# Altium project Manette2Course.PrjPcb
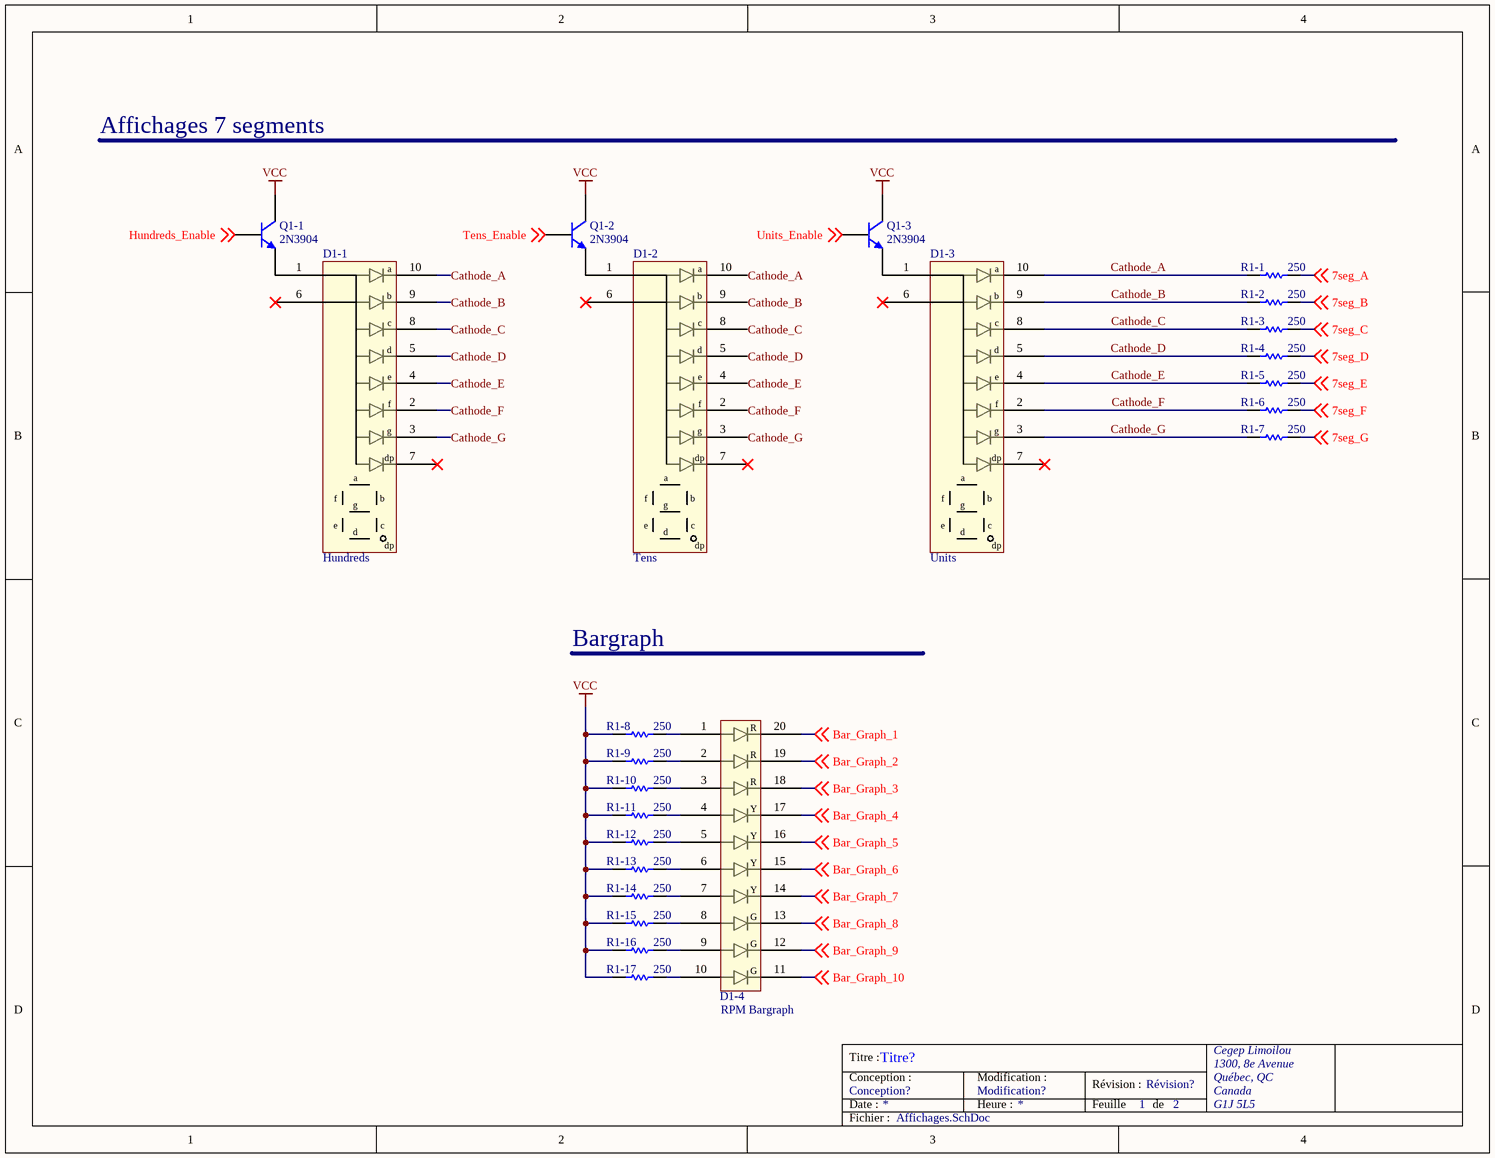
[diagram p0: Affichages.SchDoc]
2 sheets, 34 parts. Net scope: global (net labels, ports and power ports of the same name join across sheets).
Board file: manette.PcbDoc
Sheets:
  Affichages.SchDoc
  Controles.SchDoc

## Sheet Affichages.SchDoc
size Letter; Organization: Cegep Limoilou; Address1: 1300, 8e Avenue; Address2: Québec, QC; Address3: Canada; Address4: G1J 5L5; Revision: Révision?; SheetNumber: 1; SheetTotal: 2; Conception: Conception?; Titre: Titre?; Modification: Modification?; SPICEModelCacheSUUBYXOL: <root> / <DocumentId>SUUBYXOL</DocumentId> / <CacheFrame Number="0"> / <Model Name="2n3904" Kind="MDL"> / <Text>*2N3904 / *Si 310mW  40V 200mA 300MHz pkg:TO-92B 1,2,3 / .MODEL 2N3904 NPN(IS=1.4E-14 BF=300 VAF=100 IKF=0.025 ISE=3E-13 / + BR=7.5 RC=2.4 CJE=4.5E-12 TF=4E-10 CJC=3.5E-12 TR=2.1E-8 XTB=1.5 KF=9E-16 )</Text> / </Model> / </CacheFrame> / </root>

### Parts
D1-1  Hundreds  [LED_7SEG_LSHD-A101]
D1-2  Tens  [LED_7SEG_LSHD-A101]
D1-3  Units  [LED_7SEG_LSHD-A101]
D1-4  RPM Bargraph  [LED_BARGRAPH-HDSP-4832]
Q1-1  2N3904  [TO-92A]
Q1-2  2N3904  [TO-92A]
Q1-3  2N3904  [TO-92A]
R1-1  value 250  [AXIAL-0.3]  (hidden comment: Res1)
R1-2  value 250  [AXIAL-0.3]  (hidden comment: Res1)
R1-3  value 250  [AXIAL-0.3]  (hidden comment: Res1)
R1-4  value 250  [AXIAL-0.3]  (hidden comment: Res1)
R1-5  value 250  [AXIAL-0.3]  (hidden comment: Res1)
R1-6  value 250  [AXIAL-0.3]  (hidden comment: Res1)
R1-7  value 250  [AXIAL-0.3]  (hidden comment: Res1)
R1-8  value 250  [AXIAL-0.3]  (hidden comment: Res1)
R1-9  value 250  [AXIAL-0.3]  (hidden comment: Res1)
R1-10  value 250  [AXIAL-0.3]  (hidden comment: Res1)
R1-11  value 250  [AXIAL-0.3]  (hidden comment: Res1)
R1-12  value 250  [AXIAL-0.3]  (hidden comment: Res1)
R1-13  value 250  [AXIAL-0.3]  (hidden comment: Res1)
R1-14  value 250  [AXIAL-0.3]  (hidden comment: Res1)
R1-15  value 250  [AXIAL-0.3]  (hidden comment: Res1)
R1-16  value 250  [AXIAL-0.3]  (hidden comment: Res1)
R1-17  value 250  [AXIAL-0.3]  (hidden comment: Res1)

### Nets
VCC: Q1-1.3(C) Q1-2.3(C) Q1-3.3(C) R1-8.2 R1-9.2 R1-10.2 R1-11.2 R1-12.2 R1-13.2 R1-14.2 R1-15.2 R1-16.2 R1-17.2
7seg_A: R1-1.2 ; off-sheet 7seg_A
7seg_B: R1-2.2 ; off-sheet 7seg_B
7seg_C: R1-3.2 ; off-sheet 7seg_C
7seg_D: R1-4.2 ; off-sheet 7seg_D
7seg_E: R1-5.2 ; off-sheet 7seg_E
7seg_F: R1-6.2 ; off-sheet 7seg_F
7seg_G: R1-7.2 ; off-sheet 7seg_G
Bar_Graph_1: D1-4.20(K_A) ; off-sheet Bar_Graph_1
Bar_Graph_2: D1-4.19(K_B) ; off-sheet Bar_Graph_2
Bar_Graph_3: D1-4.18(K_C) ; off-sheet Bar_Graph_3
Bar_Graph_4: D1-4.17(K_D) ; off-sheet Bar_Graph_4
Bar_Graph_5: D1-4.16(K_E) ; off-sheet Bar_Graph_5
Bar_Graph_6: D1-4.15(K_F) ; off-sheet Bar_Graph_6
Bar_Graph_7: D1-4.14(K_G) ; off-sheet Bar_Graph_7
Bar_Graph_8: D1-4.13(K_H) ; off-sheet Bar_Graph_8
Bar_Graph_9: D1-4.12(K_I) ; off-sheet Bar_Graph_9
Bar_Graph_10: D1-4.11(K_J) ; off-sheet Bar_Graph_10
Cathode_A: D1-1.10(K_A) D1-2.10(K_A) D1-3.10(K_A) R1-1.1
Cathode_B: D1-1.9(K_B) D1-2.9(K_B) D1-3.9(K_B) R1-2.1
Cathode_C: D1-1.8(K_C) D1-2.8(K_C) D1-3.8(K_C) R1-3.1
Cathode_D: D1-1.5(K_D) D1-2.5(K_D) D1-3.5(K_D) R1-4.1
Cathode_E: D1-1.4(K_E) D1-2.4(K_E) D1-3.4(K_E) R1-5.1
Cathode_F: D1-1.2(K_F) D1-2.2(K_F) D1-3.2(K_F) R1-6.1
Cathode_G: D1-1.3(K_G) D1-2.3(K_G) D1-3.3(K_G) R1-7.1
Hundreds_Enable: Q1-1.2(B) ; off-sheet Hundreds_Enable
Tens_Enable: Q1-2.2(B) ; off-sheet Tens_Enable
Units_Enable: Q1-3.2(B) ; off-sheet Units_Enable
NetD1-1_1: D1-1.1(ANODE) Q1-1.1(E)
NetD1-2_1: D1-2.1(ANODE) Q1-2.1(E)
NetD1-3_1: D1-3.1(ANODE) Q1-3.1(E)
NetD1-4_1: D1-4.1(AN_A) R1-8.1
NetD1-4_2: D1-4.2(AN_B) R1-9.1
NetD1-4_3: D1-4.3(AN_C) R1-10.1
NetD1-4_4: D1-4.4(AN_D) R1-11.1
NetD1-4_5: D1-4.5(AN_E) R1-12.1
NetD1-4_6: D1-4.6(AN_F) R1-13.1
NetD1-4_7: D1-4.7(AN_G) R1-14.1
NetD1-4_8: D1-4.8(AN_H) R1-15.1
NetD1-4_9: D1-4.9(AN_I) R1-16.1
NetD1-4_10: D1-4.10(AN_J) R1-17.1

Not connected (* = marked no-connect by the designer): D1-1 6(ANODE)* 7(K_H)*; D1-2 6(ANODE)* 7(K_H)*; D1-3 6(ANODE)* 7(K_H)*

### Notes on the sheet
- Affichages 7 segments
- Bargraph
- Titre :
- Conception :
- Date :
- Modification :
- Heure :
- Révision :
- Feuille
- de
- Fichier :
- (in symbol LED_7SEG_LSHD-A101) a; b; c; d; e; f; g; dp
- (in symbol LED_BARGRAPH_HDSP-4832) R; Y; G

### Library data of the parts
D1-1-D1-3 = LED_7SEG_LSHD-A101: LED 7 segment display; Mfg: Lite-On; Mfg_PN: LSHD-A101; Supplier1: Digikey; Supplier1_PN: 160-1572-5-ND
D1-4 = LED_BARGRAPH_HDSP-4832: LED bargraph; Mfg: Broadcom; Mfg_PN: HDSP-4832; Supplier1: Digikey; Supplier1_PN: 516-1236-5-ND
Q1-1-Q1-3 = 2N3904: NPN General Purpose Amplifier; Published: 8-Jun-2000; LatestRevisionDate: 15-Jan-2003; LatestRevisionNote: PCB Footprint 'BCY-W3/D4.7' replaced; DatasheetVersion: 1997; PackageVersion: Sep-1998; PackageReference: TO-92A; Publisher: Altium Limited; PackageDescription: TO, Flat Index; 3 In-Line, Axial Leads; Body Dia. 4.5mm; Leads 0.51 x 0.48 mm (max); ComponentLink1Description: Manufacturer Link; ComponentLink1URL: http://www.fairchildsemi.com/; ComponentLink2Description: Datasheet; ComponentLink2URL: http://www.fairchildsemi.com/ds/2N%2F2N3904.pdf
R1-1-R1-17 = Res1: Resistor; Published: 8-Jun-2000; LatestRevisionDate: 17-Jul-2002; LatestRevisionNote: Re-released for DXP Platform.; PackageReference: AXIAL-0.3; Publisher: Altium Limited; PackageDescription: Axial Device, Thru-Hole; 2 Leads; 0.3 in Pin Spacing

## Sheet Controles.SchDoc
size Letter; Organization: Cegep Limoilou; Address1: 1300, 8e Avenue; Address2: Québec, QC; Address3: Canada; Address4: G1J 5L5; Revision: Révision?; SheetNumber: 2; SheetTotal: 2; Conception: Conception?; Titre: Titre?; Modification: Modification?; SPICEModelCacheSUUBYXOL: <root> / <DocumentId>SUUBYXOL</DocumentId> / </root>
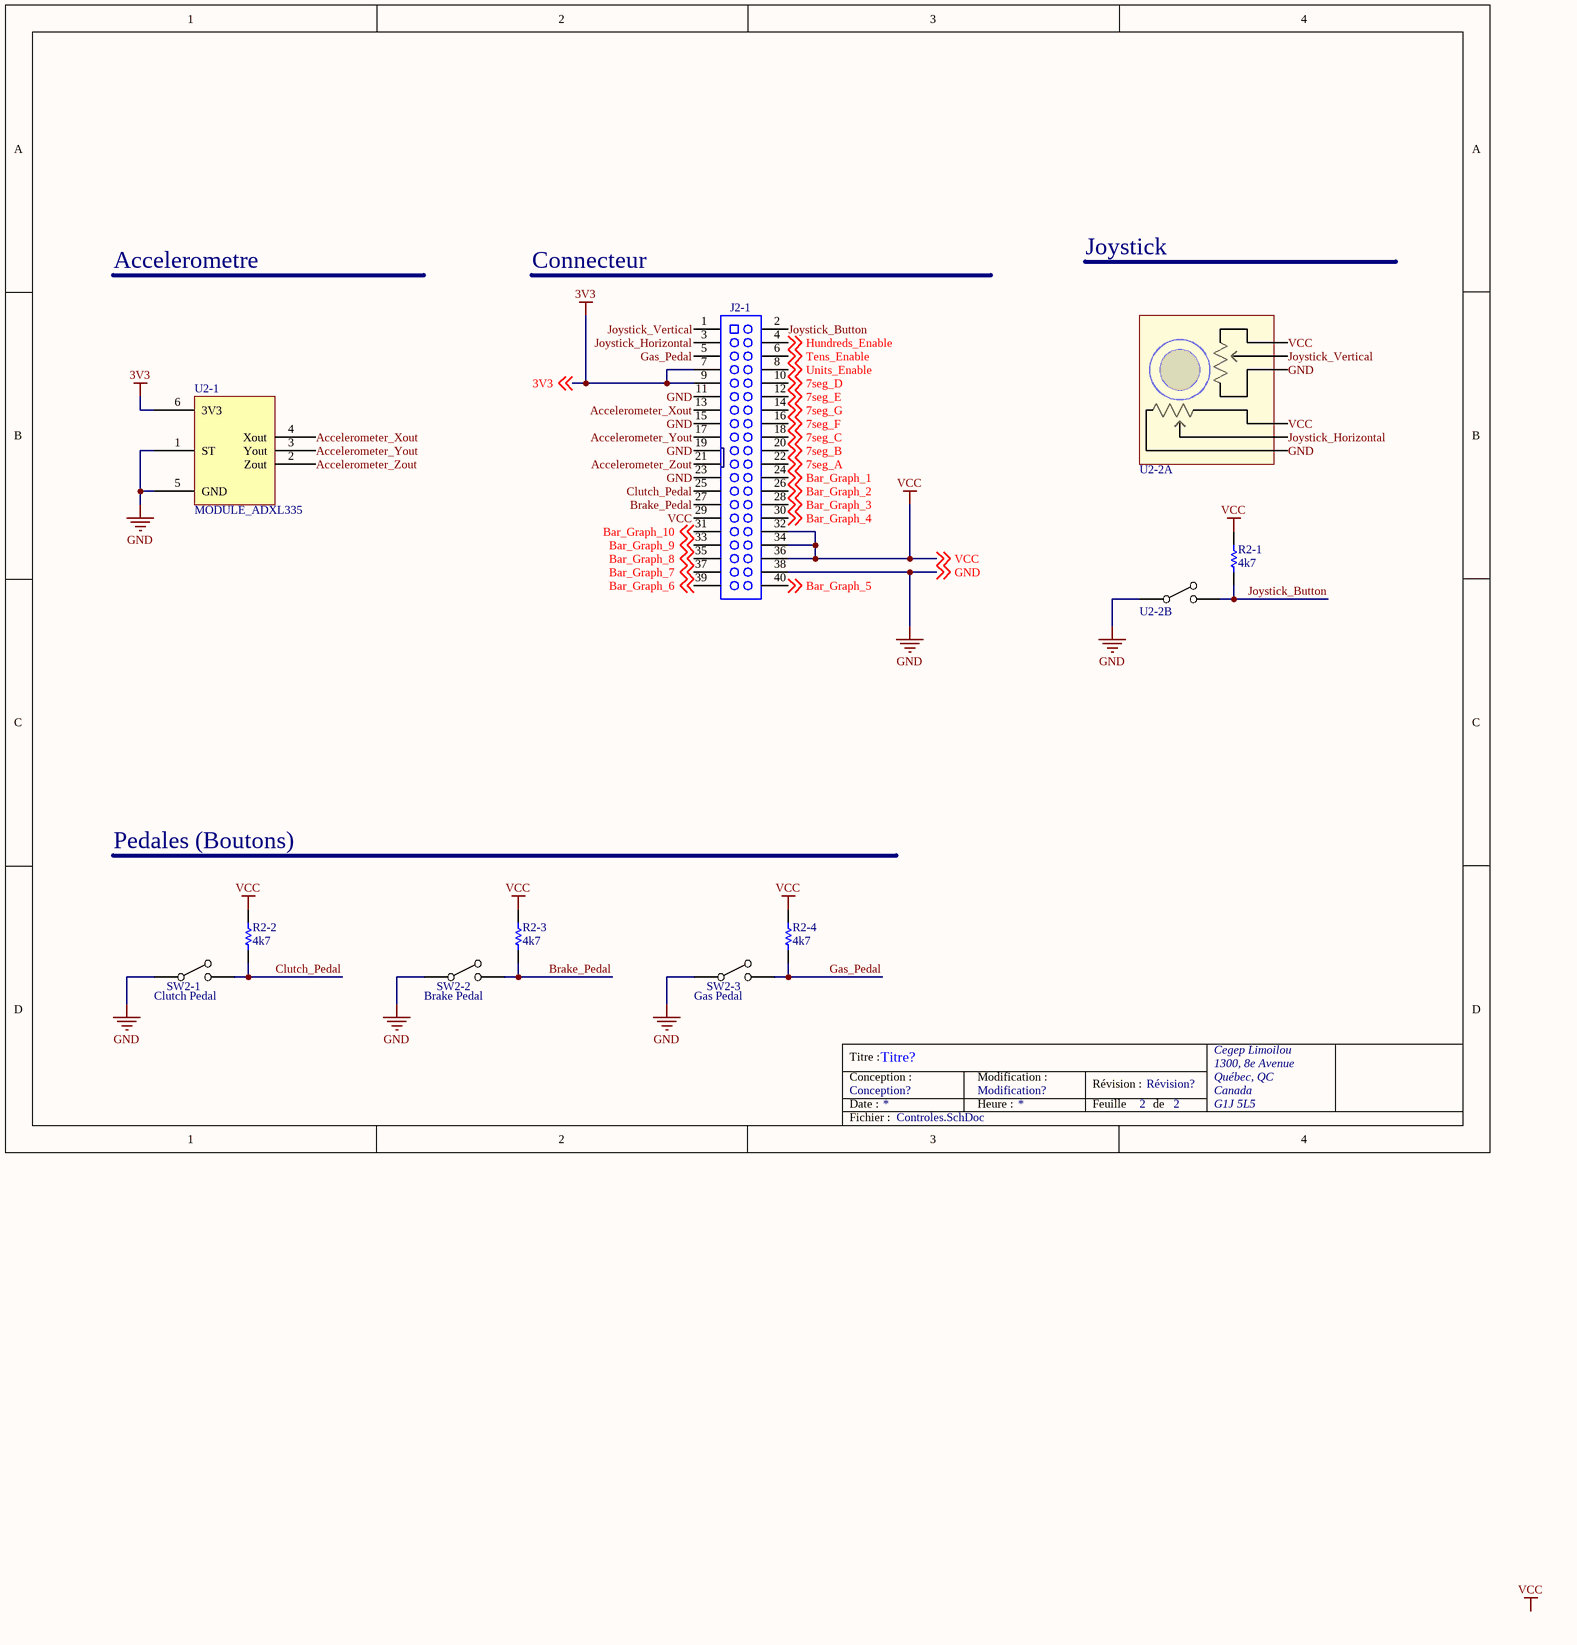
[diagram p1: Controles.SchDoc]

### Parts
J2-1  Header  [CONN_HDR_100mils_2x20]  (value not drawn)
R2-1  value 4k7  [AXIAL-0.3]  (hidden comment: Res1)
R2-2  value 4k7  [AXIAL-0.3]  (hidden comment: Res1)
R2-3  value 4k7  [AXIAL-0.3]  (hidden comment: Res1)
R2-4  value 4k7  [AXIAL-0.3]  (hidden comment: Res1)
SW2-1  Clutch Pedal  [BUTTON_SPST_WS-TATV]
SW2-2  Brake Pedal  [BUTTON_SPST_WS-TATV]
SW2-3  Gas Pedal  [BUTTON_SPST_WS-TATV]
U2-1  MODULE_ADXL335  [MODULE_ADXL335]
U2-2  Dual-axis joystick  [BTN_JOYSTICK_COM-09032]  (value not drawn)  (parts A,B of 2)

### Nets
3V3: J2-1.7 J2-1.9 U2-1.6(3V3) ; off-sheet 3V3
GND: J2-1.11 J2-1.15 J2-1.19 J2-1.23 J2-1.38 SW2-1.1 SW2-2.1 SW2-3.1 U2-1.1(ST) U2-1.5(GND) U2-2.SW_A(A) U2-2.X1(CCW) U2-2.Y1(CCW) ; off-sheet GND
VCC: J2-1.29 J2-1.32 J2-1.34 J2-1.36 R2-1.2 R2-2.2 R2-3.2 R2-4.2 U2-2.X3(CW) U2-2.Y3(CW) ; off-sheet VCC
7seg_A: J2-1.22 ; off-sheet 7seg_A
7seg_B: J2-1.20 ; off-sheet 7seg_B
7seg_C: J2-1.18 ; off-sheet 7seg_C
7seg_D: J2-1.10 ; off-sheet 7seg_D
7seg_E: J2-1.12 ; off-sheet 7seg_E
7seg_F: J2-1.16 ; off-sheet 7seg_F
7seg_G: J2-1.14 ; off-sheet 7seg_G
Accelerometer_Xout: J2-1.13 U2-1.4(Xout)
Accelerometer_Yout: J2-1.17 U2-1.3(Yout)
Accelerometer_Zout: J2-1.21 U2-1.2(Zout)
Bar_Graph_1: J2-1.24 ; off-sheet Bar_Graph_1
Bar_Graph_2: J2-1.26 ; off-sheet Bar_Graph_2
Bar_Graph_3: J2-1.28 ; off-sheet Bar_Graph_3
Bar_Graph_4: J2-1.30 ; off-sheet Bar_Graph_4
Bar_Graph_5: J2-1.40 ; off-sheet Bar_Graph_5
Bar_Graph_6: J2-1.39 ; off-sheet Bar_Graph_6
Bar_Graph_7: J2-1.37 ; off-sheet Bar_Graph_7
Bar_Graph_8: J2-1.35 ; off-sheet Bar_Graph_8
Bar_Graph_9: J2-1.33 ; off-sheet Bar_Graph_9
Bar_Graph_10: J2-1.31 ; off-sheet Bar_Graph_10
Brake_Pedal: J2-1.27 R2-3.1 SW2-2.2
Clutch_Pedal: J2-1.25 R2-2.1 SW2-1.2
Gas_Pedal: J2-1.5 R2-4.1 SW2-3.2
Hundreds_Enable: J2-1.4 ; off-sheet Hundreds_Enable
Joystick_Button: J2-1.2 R2-1.1 U2-2.SW_B(B)
Joystick_Horizontal: J2-1.3 U2-2.X2(W)
Joystick_Vertical: J2-1.1 U2-2.Y2(W)
Tens_Enable: J2-1.6 ; off-sheet Tens_Enable
Units_Enable: J2-1.8 ; off-sheet Units_Enable

### Notes on the sheet
- Accelerometre
- Connecteur
- Joystick
- Pedales (Boutons)
- Labels drawn without touching a wire or pin: VCC
- Titre :
- Conception :
- Date :
- Modification :
- Heure :
- Révision :
- Feuille
- de
- Fichier :

### Library data of the parts
J2-1 = CONN_DUALROW_2x20: IDC Boxed Header, Straight, PCB Mount, Polarised, 40 Way, 2x20, 0.1" Pitch; Mfg: Sullins; Mfg_PN: SBH11-PBPC-D20-ST-BK; Supplier1: Digikey; Supplier1_PN: S9175-ND
R2-1-R2-4 = Res1: Resistor; Published: 8-Jun-2000; LatestRevisionDate: 17-Jul-2002; LatestRevisionNote: Re-released for DXP Platform.; PackageReference: AXIAL-0.3; Publisher: Altium Limited; PackageDescription: Axial Device, Thru-Hole; 2 Leads; 0.3 in Pin Spacing
SW2-1-SW2-3 = BTN_SPST: SPST Button; Mfg: Wurth; Mfg_PN: 430186070716; Supplier1: Digikey; Supplier1_PN: 430186070716-ND
U2-1 = MODULE_ADXL335: Accelerometre
U2-2 = BTN_JOYSTICK_COM-09032: Joystick deux-axes, sorties "potentiometres"; Mfg: Sparkfun; Supplier1_PN: 1568-1526-ND; Supplier1: Digikey; Mfg_PN: COM-09032

## Nets that join several sheets
VCC: Affichages (13 pins), Controles (10 pins)
7seg_A: Affichages (R1-1.2), Controles (J2-1.22)
7seg_B: Affichages (R1-2.2), Controles (J2-1.20)
7seg_C: Affichages (R1-3.2), Controles (J2-1.18)
7seg_D: Affichages (R1-4.2), Controles (J2-1.10)
7seg_E: Affichages (R1-5.2), Controles (J2-1.12)
7seg_F: Affichages (R1-6.2), Controles (J2-1.16)
7seg_G: Affichages (R1-7.2), Controles (J2-1.14)
Bar_Graph_1: Affichages (D1-4.20), Controles (J2-1.24)
Bar_Graph_2: Affichages (D1-4.19), Controles (J2-1.26)
Bar_Graph_3: Affichages (D1-4.18), Controles (J2-1.28)
Bar_Graph_4: Affichages (D1-4.17), Controles (J2-1.30)
Bar_Graph_5: Affichages (D1-4.16), Controles (J2-1.40)
Bar_Graph_6: Affichages (D1-4.15), Controles (J2-1.39)
Bar_Graph_7: Affichages (D1-4.14), Controles (J2-1.37)
Bar_Graph_8: Affichages (D1-4.13), Controles (J2-1.35)
Bar_Graph_9: Affichages (D1-4.12), Controles (J2-1.33)
Bar_Graph_10: Affichages (D1-4.11), Controles (J2-1.31)
Hundreds_Enable: Affichages (Q1-1.2), Controles (J2-1.4)
Tens_Enable: Affichages (Q1-2.2), Controles (J2-1.6)
Units_Enable: Affichages (Q1-3.2), Controles (J2-1.8)